# Altium schematic sheet VSYNC.SchDoc: VSYNC
size A4; SheetNumber: 3
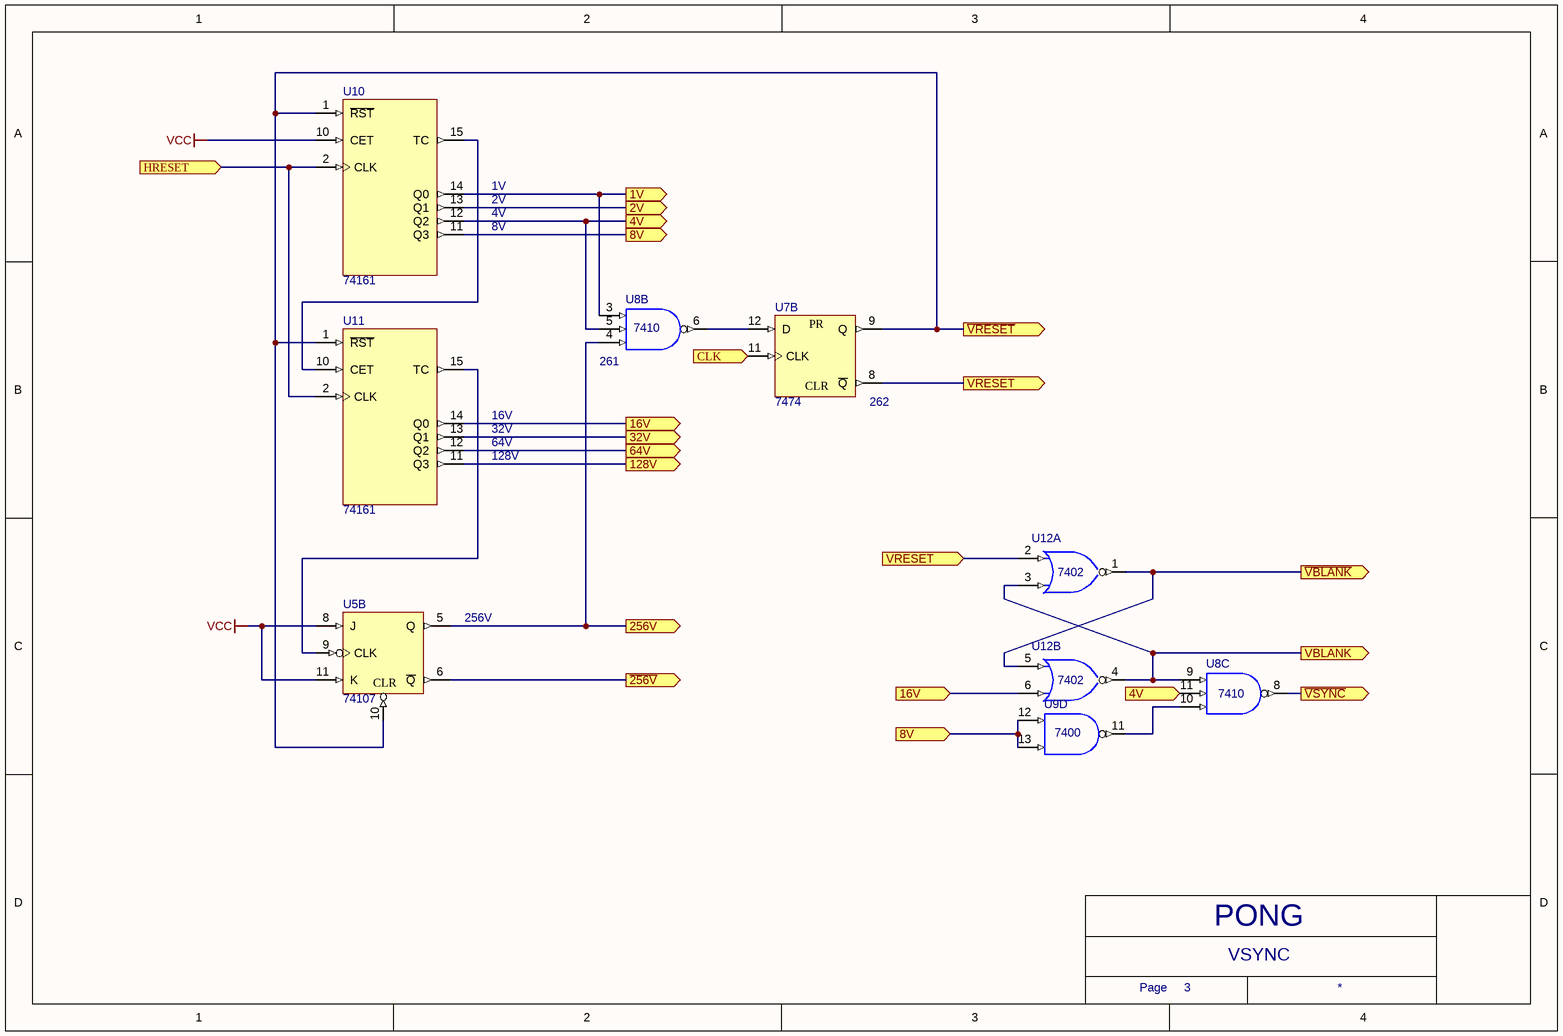
[diagram p0: VSYNC.SchDoc]

## Parts
U5  74107  [N014]  (part B of 2)
U7  7474  [N014D]  (part B of 2)
U8  7410  [N014]  (parts B,C of 3)
U9  7400  [N014]  (part D of 4)
U10  74161  [N016]
U11  74161  [N016]
U12  7402  [N014]  (parts A,B of 4)

## Ports
1V, 2V, 4V, 8V, 16V, 32V, 64V, 128V, 256V, CLK, HRESET, VBLANK, VRESET, ~{256V}, ~{VBLANK}, ~{VRESET}, ~{VSYNC}

## Nets
GND: U5.7(GND) U7.7(GND) U8.7(GND) U9.7(GND) U10.8(GND) U11.8(GND) U12.7(GND)
VCC: U5.8(J) U5.11(K) U5.14(VCC) U7.10(PR) U7.13(CLR) U7.14(VCC) U8.14(VCC) U9.14(VCC) U10.3(P0) U10.4(P1) U10.5(P2) U10.6(P3) U10.7(CEP) U10.9(~{PE}) U10.10(CET) U10.16(VCC) U11.3(P0) U11.4(P1) U11.5(P2) U11.6(P3) U11.7(CEP) U11.9(~{PE}) U11.16(VCC) U12.14(VCC)
1V: U8.3(A) U10.14(Q0) ; port 1V
2V: U10.13(Q1) ; port 2V
4V: U8.5(C) U8.11(C) U10.12(Q2) ; port 4V
8V: U9.12(A) U9.13(B) U10.11(Q3) ; port 8V
16V: U11.14(Q0) U12.6(B) ; port 16V
32V: U11.13(Q1) ; port 32V
64V: U11.12(Q2) ; port 64V
128V: U11.11(Q3) ; port 128V
256V: U5.5(Q) U8.4(B) ; port 256V
~{256V}: U5.6(~{Q}) ; port ~{256V}
~{VBLANK}: U12.1(Y) U12.5(A) ; port ~{VBLANK}
~{VRESET}: U5.10(CLR) U7.9(Q) U10.1(~{RST}) U11.1(~{RST}) ; port ~{VRESET}
~{VSYNC}: U8.8(Y) ; port ~{VSYNC}
CLK: U7.11(CLK) ; port CLK
HRESET: U10.2(CLK) U11.2(CLK) ; port HRESET
VBLANK: U8.9(A) U12.3(B) U12.4(Y) ; port VBLANK
VRESET: U7.8(~{Q}) U12.2(A) ; port VRESET
NetU5_9: U5.9(CLK) U11.15(TC)
NetU7_12: U7.12(D) U8.6(Y)
NetU8_10: U8.10(B) U9.11(Y)
NetU10_15: U10.15(TC) U11.10(CET)

## Notes on the sheet
- 1V
- 2V
- 4V
- 8V
- (near U8) 261
- 16V
- 32V
- 64V
- (near U7) 262
- 128V
- (near U5) 256V
- Text
- Page
- PONG

## Library data of the parts
U5 = SN74LS107AN: Dual J-K Flip-Flop with Clear; Published: 8-Jun-2000; LatestRevisionDate: 04-Mar-2005; LatestRevisionNote: Stylized 3D Model Added.; DatasheetVersion: Mar-1988; PackageVersion: Oct-1995; PackageReference: N014; Publisher: Altium Limited; PackageDescription: DIP; 14 Leads; Row Spacing 7.62 mm; Pitch 2.54 mm; ComponentLink1Description: Manufacturer Link; ComponentLink1URL: http://www.ti.com/; ComponentLink2Description: Datasheet; ComponentLink2URL: http://www-s.ti.com/sc/ds/sn74ls107a.pdf
U7 = SN74LS74AN: Dual D-Type Positive-Edge-Triggered Flip-Flop with Preset and Clear; Published: 8-Jun-2000; LatestRevisionDate: 04-Mar-2005; LatestRevisionNote: Stylized 3D Model Added.; DatasheetVersion: Mar-1988; PackageVersion: Oct-1995; PackageReference: N014D; Publisher: Altium Limited; PackageDescription: DIP; 14 Leads; Row Spacing 7.62 mm; Pitch 2.54 mm; ComponentLink1Description: Manufacturer Link; ComponentLink1URL: http://www.ti.com/; ComponentLink2Description: Datasheet; ComponentLink2URL: http://www-s.ti.com/sc/ds/sn74ls74a.pdf
U8 = SN74LS10N: Triple 3-Input Positive-NAND Gate; Published: 8-Jun-2000; LatestRevisionDate: 04-Mar-2005; LatestRevisionNote: Stylized 3D Model Added.; DatasheetVersion: Mar-1988; PackageVersion: Oct-1995; PackageReference: N014; Publisher: Altium Limited; PackageDescription: DIP; 14 Leads; Row Spacing 7.62 mm; Pitch 2.54 mm; ComponentLink1Description: Manufacturer Link; ComponentLink1URL: http://www.ti.com/; ComponentLink2Description: Datasheet; ComponentLink2URL: http://www-s.ti.com/sc/ds/sn74ls10.pdf
U9 = SN74LS00N: Quadruple 2-Input Positive-NAND Gate; Published: 8-Jun-2000; LatestRevisionDate: 04-Mar-2005; LatestRevisionNote: Stylized 3D Model Added.; DatasheetVersion: Mar-1988; PackageVersion: Oct-1995; PackageReference: N014; Publisher: Altium Limited; PackageDescription: DIP; 14 Leads; Row Spacing 7.62 mm; Pitch 2.54 mm; ComponentLink1Description: Manufacturer Link; ComponentLink1URL: http://www.ti.com/; ComponentLink2Description: Datasheet; ComponentLink2URL: http://www-s.ti.com/sc/ds/sn74ls00.pdf
U10 U11 = SN74LS161AN: Synchronous 4-Bit Counter; Published: 8-Jun-2000; LatestRevisionDate: 04-Mar-2005; LatestRevisionNote: Stylized 3D Model Added.; DatasheetVersion: Mar-1988; PackageVersion: Oct-1995; PackageReference: N016; Publisher: Altium Limited; PackageDescription: DIP; 16 Leads; Row Spacing 7.62 mm; Pitch 2.54 mm; Code_JEDEC: MS-001-BB; ComponentLink1Description: Manufacturer Link; ComponentLink1URL: http://www.ti.com/; ComponentLink2Description: Datasheet; ComponentLink2URL: http://www-s.ti.com/sc/ds/sn74ls161a.pdf; ComponentLink3Description: URL Link1; ComponentLink3URL: http://focus.ti.com/docs/prod/folders/print/sn74ls161a.html
U12 = SN74LS02N: Quadruple 2-Input Positive-NOR Gate; Published: 8-Jun-2000; LatestRevisionDate: 04-Mar-2005; LatestRevisionNote: Stylized 3D Model Added.; DatasheetVersion: Mar-1988; PackageVersion: Oct-1995; PackageReference: N014; Publisher: Altium Limited; PackageDescription: DIP; 14 Leads; Row Spacing 7.62 mm; Pitch 2.54 mm; ComponentLink1Description: Manufacturer Link; ComponentLink1URL: http://www.ti.com/; ComponentLink2Description: Datasheet; ComponentLink2URL: http://www-s.ti.com/sc/ds/sn54s02.pdf